# EAGLE design 234_humidity (EAGLE 9.6.2)
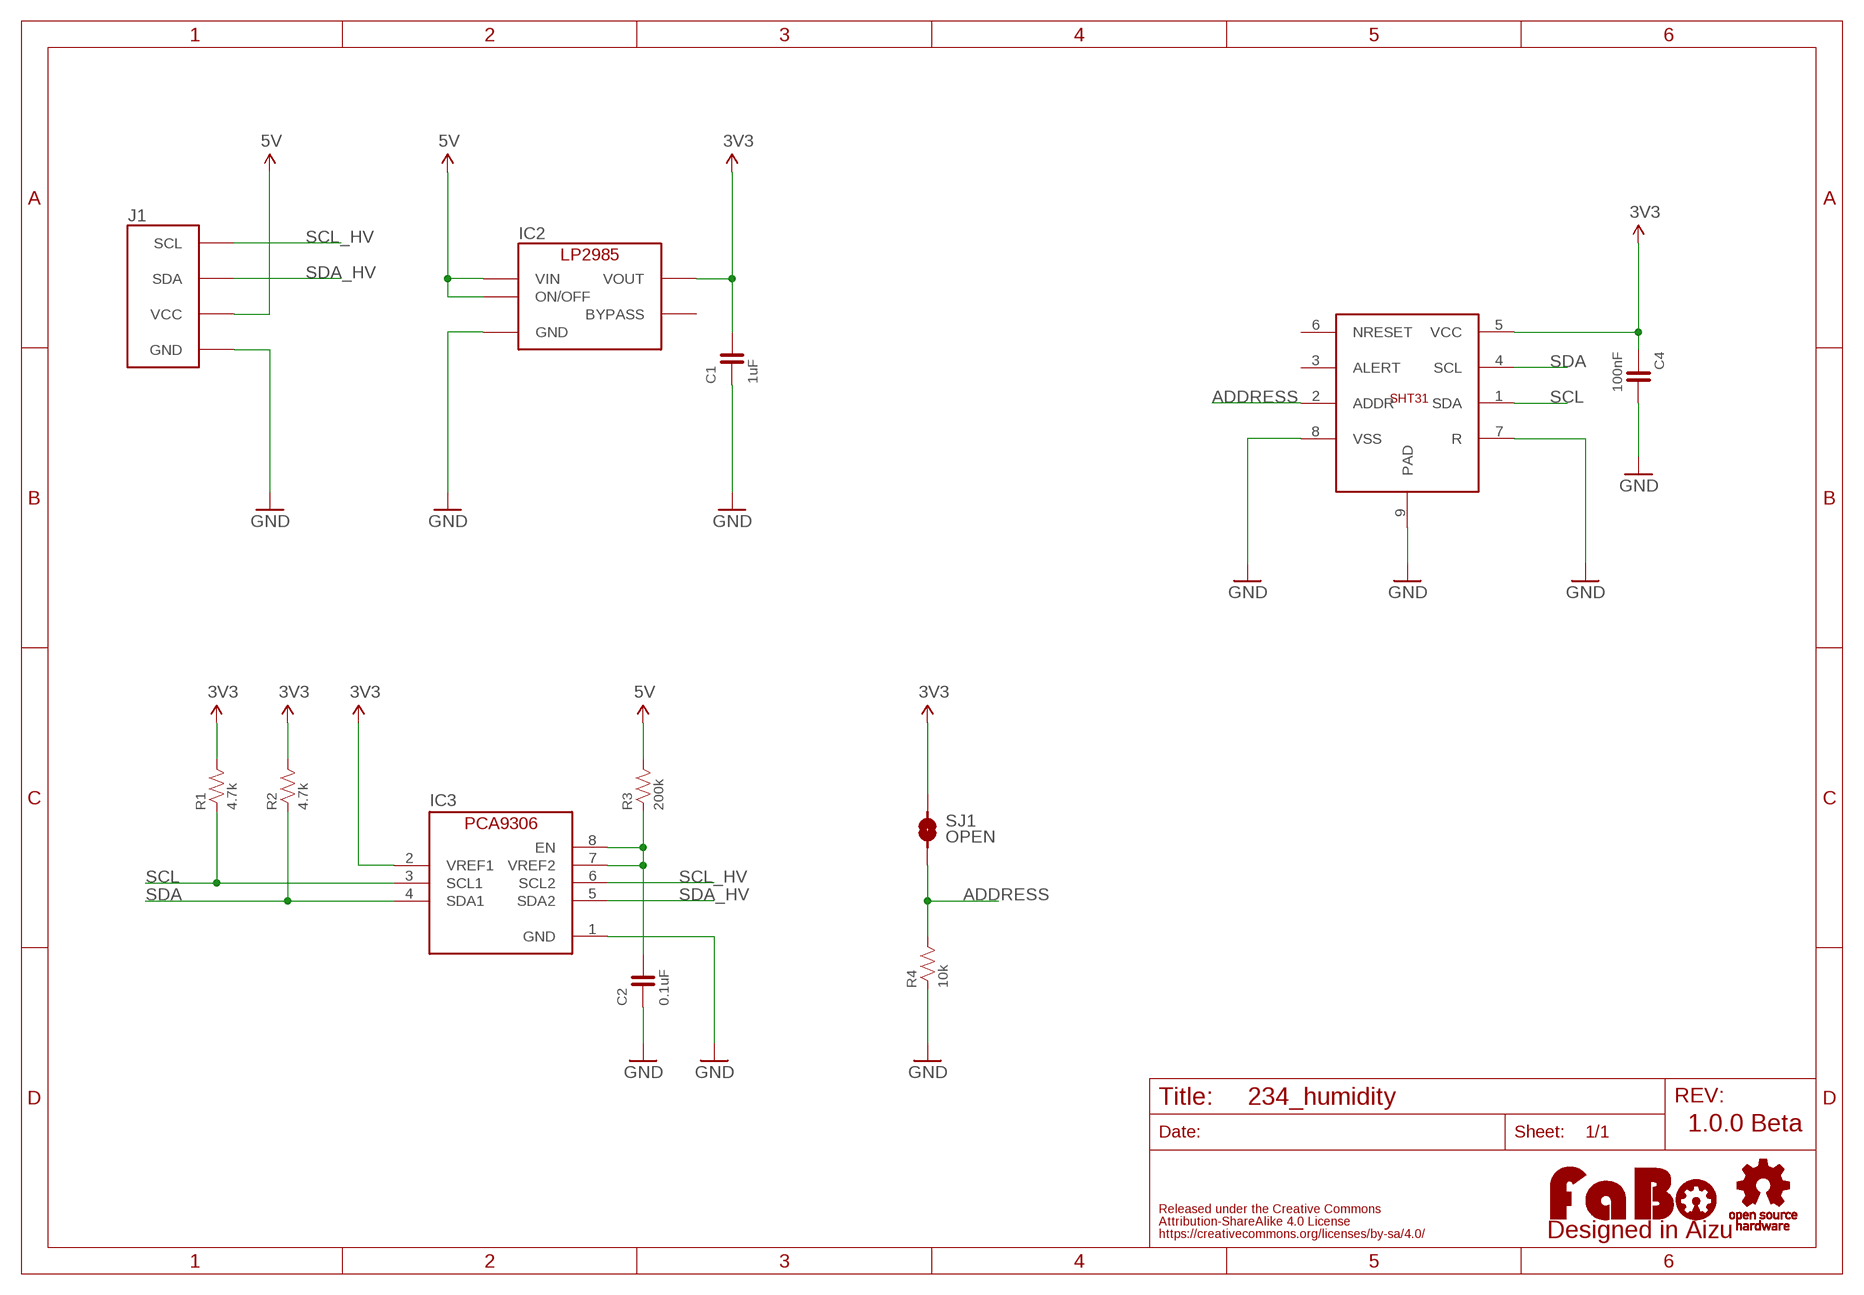
[diagram p0: schematic, sheet 1]

## Parts
C1  1uF  CAPACITOR-0603  [0603]
C2  0.1uF  CAPACITOR-0603  [0603]
C4  100nF  CAPACITOR-0603  [0603]
IC2  LP2985-33DBV  [SOT-23-5]
IC3  PCA9306GM  [XQFN8]
J1  FABO_BRICK_I2C  [FABO_BRICK_I2C]
LOGO1  LOGO_FABO-M  [LOGO_FABO_M]
R1  4.7k  RESISTOR-0603  [0603]
R2  4.7k  RESISTOR-0603  [0603]
R3  200k  RESISTOR-0603  [0603]
R4  10k  RESISTOR-0603  [0603]
SHT31  SHT31  SENSARION-SHT31  [SENSARION-SHT31]
SJ1  OPEN  SMD-JUMPER-2  [SMD-JUMPER-2]
U$2  LOGO_OSHW-M_BOTTOM  [LOGO_OSHW_M_BOTTOM]

## Nets
3V3: C1.2 C4.1 IC2.5(VOUT) IC3.2(VREF1) R1.2 R2.2 SHT31.5(VCC) SJ1.1
5V: IC2.1(VIN) IC2.3(ON/OFF) J1.VCC R3.2
ADDRESS: R4.2 SHT31.2(ADDR) SJ1.2
GND: C1.1 C2.1 C4.2 IC2.2(GND) IC3.1(GND) J1.GND R4.1 SHT31.7(R) SHT31.8(VSS) SHT31.9(PAD)
N$1: C2.2 IC3.7(VREF2) IC3.8(EN) R3.1
SCL: IC3.3(SCL1) R1.1 SHT31.1(SDA)
SCL_HV: IC3.6(SCL2) J1.SCL
SDA: IC3.4(SDA1) R2.1 SHT31.4(SCL)
SDA_HV: IC3.5(SDA2) J1.SDA
Unconnected: IC2.4(BYPASS) SHT31.3(ALERT) SHT31.6(NRESET)

## Notes on the sheet
- 1.0.0 Beta

## Library data of the parts
C1 C2 C4 = FaBo-Capacitor:CAPACITOR: CAPACITOR
IC2 = FaBo-Supply:LP2985: LP2985
IC3 = FaBo-LevelTranslator:PCA9306
J1 = FaBo-Template:FABO_BRICK_I2C: FaBo Brick I2C
LOGO1 = component:LOGO_FABO
R1-R4 = FaBo-Resistors:RESISTOR: RESISTOR
SHT31 = FaBo-Environment:SENSARION-SHT31
SJ1 = FaBo-etc:SMD-JUMPER-2
U$2 = FaBo-etc:LOGO_OSHW

## Board
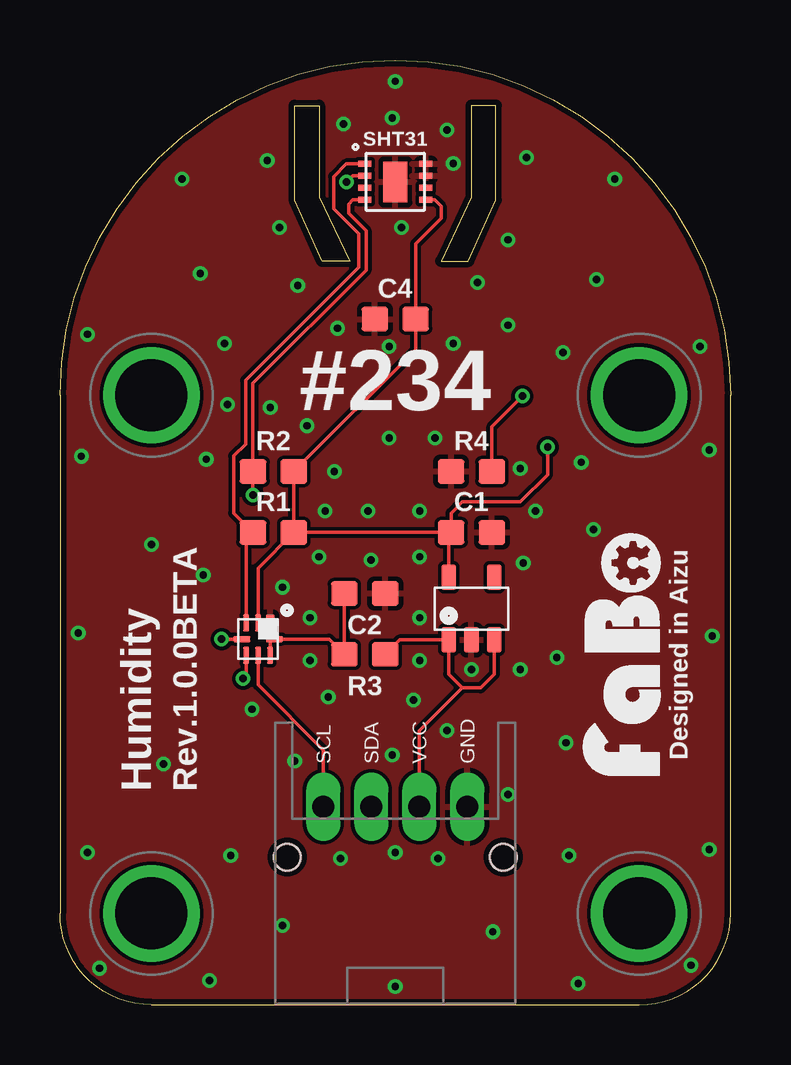
[diagram p1: board, top side]
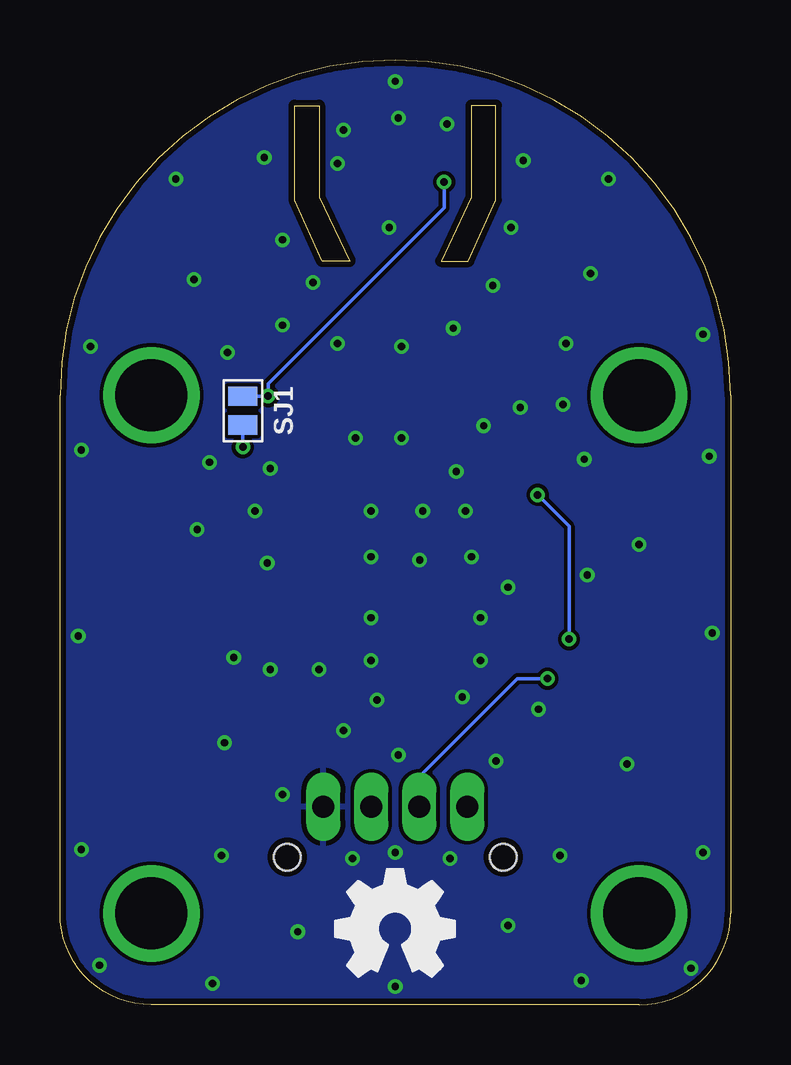
[diagram p2: board, bottom side, seen from below]

Size 27.94 x 39.37 mm. Coordinates in mm from the lower left corner, seen from the top.
Outline: 10.79,37.47 10.79,33.66 12.06,30.99 10.92,30.99 9.78,33.53 9.78,37.47 10.79,37.47
Outline: 17.14,37.47 17.14,33.66 15.88,30.99 17.02,30.99 18.16,33.53 18.16,37.47 17.14,37.47
Copper layers (1*16): Top 0.035mm / dielectric 1.6mm / Bottom 0.035mm
Design rules "PCBway": minimum track width 6mil, minimum drill 12mil, track to track 6mil, track to pad 6mil, pad to pad 6mil, via to via 6mil, smd to smd 6mil, copper to edge 10mil, drill to drill 10mil, minimum pad ring 10mil, minimum via ring 6mil, stop-mask expansion 2mil, vias tented up to drill 100mil, thermal gap 8mil

### Footprints (pad centres in the part's own frame; a part is rotated, then mirrored left to right if it is on the bottom)
0603 = smd 1.1 x 1: 1 -0.85,0; 2 0.85,0
SOT-23-5 = smd 0.6 x 1.05: 1 -0.95,-1.3; 2 0,-1.3; 3 0.95,-1.3; 4 0.95,1.3; 5 -0.95,1.3
XQFN8 = smd 0.7 x 0.35: 1 -0.675,0.5 | smd 0.7 x 0.25: 2 -0.675,0; 3 -0.675,-0.5; 5 0.675,-0.5; 6 0.675,0; 7 0.675,0.5 | smd 0.25 x 0.7: 4 0,-0.675; 8 0,0.675
FABO_BRICK_I2C = drill 0.9 pad 1.422 long: GND 3,-10.795; SCL -3,-10.795; SDA -1,-10.795; VCC 1,-10.795 | drill 3 pad 3.81: P$1 -10.16,6.35; P$2 10.16,6.35; P$3 -10.16,-15.24; P$4 10.16,-15.24 | hole 1.1: -4.5,-12.895; 4.5,-12.895
SENSARION-SHT31 = smd 0.55 x 0.25: 1 -1.275,0.75; 2 -1.275,0.25; 3 -1.275,-0.25; 4 -1.275,-0.75; 5 1.275,-0.75; 6 1.275,-0.25; 7 1.275,0.25; 8 1.275,0.75 | smd 1 x 1.7: 9 0,0
SMD-JUMPER-2 = smd 0.8 x 1.2: 1 -0.6,0; 2 0.6,0

### Placement (x,y rotation side)
C1  17.14,19.68 180 top
C2  12.7,17.14 180 top
C4  13.97,28.57 180 top
IC2  17.14,16.51 0 top
IC3  8.26,15.24 270 top
J1  13.97,19.05 0 top
LOGO1  25.4,14.61 90 top
R1  8.89,19.68 0 top
R2  8.89,22.23 0 top
R3  12.7,14.61 0 top
R4  17.14,22.23 0 top
SHT31  13.97,34.29 0 top
SJ1  20.32,24.77 90 bottom
U$2  13.97,3.17 0 top

### Tracks (layer width: path | path; a pad name or v marks a point on that pad's centre or on a via)
3V3  (via drill 0.3)
  Top 0.152: SHT31.5 15.61,33.54 15.88,33.27 15.88,32.77 14.82,31.71 C4.1 14.82,27.3 R2.2 R1.2 | IC2.5 16.2,19.59 C1.2 | C1.2 16.3,20.49 16.76,20.95 19.18,20.95 20.32,22.1 v20.32,23.24 | IC3.2 8.26,18.2 R1.2 | R1.2 C1.2
  Bottom 0.152: SJ1.1 v20.32,23.24
5V
  Top 0.152: 16.76,13.21 16.2,13.78 IC2.1 14.15,15.21 R3.2 | IC2.3 18.09,13.78 17.53,13.21 16.76,13.21 | J1.VCC 14.97,11.41 16.76,13.21
ADDRESS  (via drill 0.3)
  Top 0.152: SHT31.2 12.19,34.54 v11.93,34.29 | R4.2 18,24.09 v19.27,25.36
  Bottom 0.152: SJ1.2 v19.27,25.36 19.27,25.87 11.93,33.21 v11.93,34.29
GND  (via drill 0.3)
  other vias: 17.14,13.97 14.99,14.35 14.99,16.13 14.99,18.67 10.79,18.67 9.27,17.4 10.41,16.13 10.41,14.35 12.95,18.54 11.05,20.57 12.83,20.57 14.99,20.57 11.18,12.83 14.73,12.7 16.13,11.43 19.18,13.97 19.3,18.41 20.7,14.48 9.78,10.16 8,12.32 13.84,10.41 18.67,8.76 11.68,6.1 13.97,6.35 15.75,6.1 13.97,0.76 6.22,1.02 1.14,6.35 27.05,6.48 26.29,1.65 21.59,0.89 1.65,1.52 7.11,6.22 21.21,6.22 18.03,3.05 9.27,3.3 0.76,15.49 27.18,15.37 21.08,10.92 4.32,10.03 0.89,22.86 27.05,23.11 21.72,22.61 6.1,22.73 3.81,19.18 22.23,19.81 19.18,22.35 19.81,20.57 15.62,23.62 11.43,22.23 10.29,24.13 5.97,17.91 20.95,27.18 26.67,27.43 6.86,27.56 6.99,25.02 8.76,24.89 1.14,27.94 9.91,29.97 17.4,30.1 11.56,28.19 13.72,27.43 13.72,23.62 16.38,27.56 18.67,28.32 13.97,38.48 5.08,34.42 23.11,34.42 19.43,35.31 8.64,35.18 9.14,32.38 14.22,32.38 11.81,36.7 16.13,36.45 13.84,36.96 16.38,35.05 18.67,31.88 22.35,30.23 5.84,30.48
  pour Top (isolate 0.152, rank 3): 0,0 27.94,0 27.94,39.37 0,39.37
  pour Bottom (isolate 0.152, rank 3): 0,0 27.94,0 27.94,39.37 0,39.37
N$1
  Top 0.152: C2.2 R3.1 11.21,15.24 IC3.8 8.76,15.24 IC3.7
SCL
  Top 0.152: SHT31.1 11.93,35.04 11.4,34.51 11.4,33.18 12.45,32.13 12.45,30.73 7.74,26.02 7.74,23.37 7.24,22.87 7.24,20.49 R1.1 7.75,19.4 IC3.3
SCL_HV
  Top 0.152: IC3.6 8.26,13.34 10.97,10.62 J1.SCL
SDA  (via drill 0.3)
  Top 0.152: SHT31.4 12.2,33.54 12.03,33.36 12.03,32.98 12.75,32.26 12.75,30.61 8.04,25.9 R2.1 v8.04,21.25 | IC3.4 v6.73,15.24
  Bottom 0.152: v8.04,21.25 6.73,19.94 v6.73,15.24
SDA_HV  (via drill 0.3)
  Top 0.152: IC3.5 7.75,13.72 v7.63,13.6
  Bottom 0.152: v7.63,13.6 8.88,13.6 12.97,9.51 J1.SDA

### Text on the board
tPlace: #234 | Designed in Aizu | Humidity | Rev.1.0.0BETA